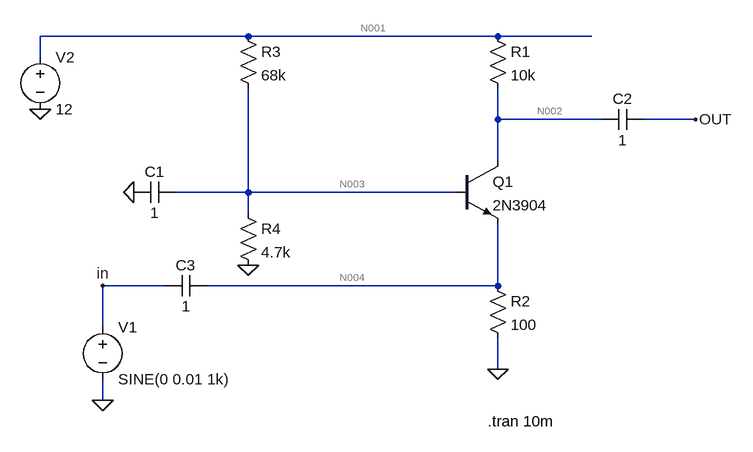
[diagram p0: schematic AC 06.asc]
AC 06.asc, the LTspice schematic file:
Version 4
SHEET 1 880 680
WIRE 48 -80 -272 -80
WIRE 432 -80 48 -80
WIRE 576 -80 432 -80
WIRE -272 -48 -272 -80
WIRE 432 48 432 0
WIRE 592 48 432 48
WIRE 736 48 656 48
WIRE 432 112 432 48
WIRE 48 160 48 0
WIRE 48 160 -64 160
WIRE 368 160 48 160
WIRE 48 192 48 160
WIRE -80 304 -176 304
WIRE 432 304 432 208
WIRE 432 304 -16 304
WIRE -176 368 -176 304
WIRE 432 432 432 384
WIRE -176 480 -176 448
FLAG -128 160 0
FLAG 432 432 0
FLAG -176 480 0
FLAG -272 32 0
FLAG 48 272 0
FLAG 736 48 OUT
FLAG -176 304 in
SYMBOL res 416 -96 R0
SYMATTR InstName R1
SYMATTR Value 10k
SYMBOL res 416 288 R0
SYMATTR InstName R2
SYMATTR Value 100
SYMBOL res 32 -96 R0
SYMATTR InstName R3
SYMATTR Value 68k
SYMBOL res 32 176 R0
SYMATTR InstName R4
SYMATTR Value 4.7k
SYMBOL npn 368 112 R0
SYMATTR InstName Q1
SYMATTR Value 2N3904
SYMBOL voltage -176 352 R0
SYMATTR InstName V1
SYMATTR Value SINE(0 0.01 1k)
SYMBOL cap -64 144 R90
WINDOW 0 0 32 VBottom 2
WINDOW 3 32 32 VTop 2
SYMATTR InstName C1
SYMATTR Value 1
SYMBOL cap 656 32 R90
WINDOW 0 0 32 VBottom 2
WINDOW 3 32 32 VTop 2
SYMATTR InstName C2
SYMATTR Value 1
SYMBOL cap -16 288 R90
WINDOW 0 0 32 VBottom 2
WINDOW 3 32 32 VTop 2
SYMATTR InstName C3
SYMATTR Value 1
SYMBOL voltage -272 -64 R0
SYMATTR InstName V2
SYMATTR Value 12
TEXT 416 512 Left 2 !.tran 10m

The netlist it stands for:
* AC 06.asc
R1 N001 N002 10k
R2 N004 0 100
R3 N001 N003 68k
R4 N003 0 4.7k
Q1 N002 N003 N004 0 2N3904
V1 in 0 SINE(0 0.01 1k)
C1 N003 0 1
C2 OUT N002 1
C3 N004 in 1
V2 N001 0 12
.model NPN NPN
.model PNP PNP
.lib standard.bjt
.tran 10m
.backanno
.end

* Results of the author's LTspice run, read from the files saved beside the schematic
* Operating Point, zero values left out:
*   V(n001) = 12 V
*   V(n002) = 1.59 V
*   V(n004) = 104.4 mV
*   V(n003) = 760.6 mV
*   V(out) = 795.2 mV
*   Ic(Q1) = 1.041 mA
*   Ib(Q1) = 3.45 µA
*   Ie(Q1) = -1.044 mA
*   I(R1) = 1.041 mA
*   I(R2) = 1.044 mA
*   I(R3) = 165.3 µA
*   I(R4) = 161.8 µA
*   I(V2) = -1.206 mA
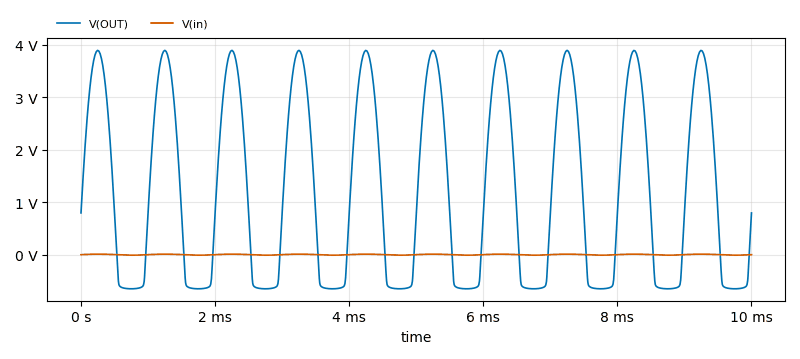
[diagram p1: Transient Analysis of AC 06.asc, plotted from the saved traces]
* Transient Analysis, 1 run:
*   V(OUT): min -650.4 mV, max 3.892 V, average 1.188 V, rms 2.15 V, last 795.1 mV
*   V(in): min -10 mV, max 10 mV, average -2.698 µV, rms 7.069 mV, last 0 V